# EAGLE design TaSCUD ver03 (EAGLE 8.1.1)
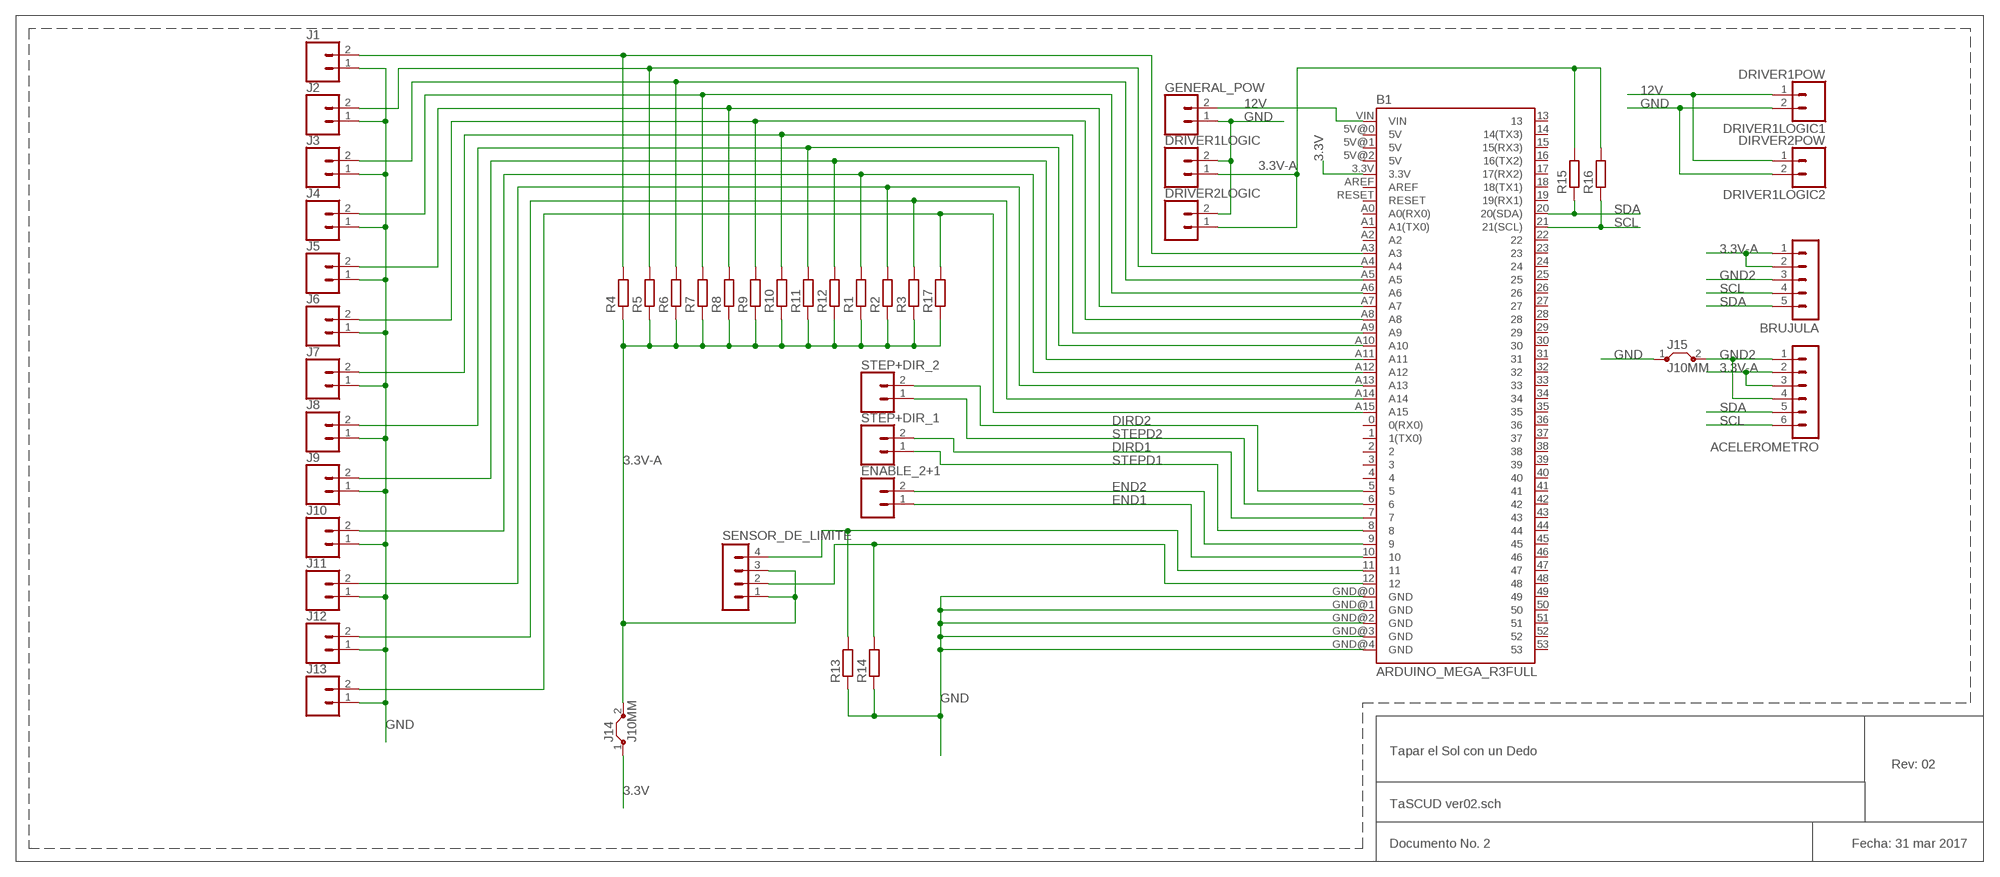
[diagram p0: schematic, sheet 1]

## Parts
ACELEROMETRO  MA06-1  [MA06-1]
B1  ARDUINO_MEGA_R3FULL  [ARDUINO_MEGA]
BRUJULA  MA05-1  [MA05-1]
DRIVER1LOGIC  CONN_023.5MM-NO_SILK  [SCREWTERMINAL-3.5MM-2-NS]
DRIVER1LOGIC1  DRIVER1POW  CONN_023.5MM-NO_SILK  [SCREWTERMINAL-3.5MM-2-NS]
DRIVER1LOGIC2  DIRVER2POW  CONN_023.5MM-NO_SILK  [SCREWTERMINAL-3.5MM-2-NS]
DRIVER2LOGIC  CONN_023.5MM-NO_SILK  [SCREWTERMINAL-3.5MM-2-NS]
ENABLE_2+1  CONN_023.5MM-NO_SILK  [SCREWTERMINAL-3.5MM-2-NS]
GENERAL_POW  CONN_023.5MM-NO_SILK  [SCREWTERMINAL-3.5MM-2-NS]
J1  CONN_023.5MM-NO_SILK  [SCREWTERMINAL-3.5MM-2-NS]
J2  CONN_023.5MM-NO_SILK  [SCREWTERMINAL-3.5MM-2-NS]
J3  CONN_023.5MM-NO_SILK  [SCREWTERMINAL-3.5MM-2-NS]
J4  CONN_023.5MM-NO_SILK  [SCREWTERMINAL-3.5MM-2-NS]
J5  CONN_023.5MM-NO_SILK  [SCREWTERMINAL-3.5MM-2-NS]
J6  CONN_023.5MM-NO_SILK  [SCREWTERMINAL-3.5MM-2-NS]
J7  CONN_023.5MM-NO_SILK  [SCREWTERMINAL-3.5MM-2-NS]
J8  CONN_023.5MM-NO_SILK  [SCREWTERMINAL-3.5MM-2-NS]
J9  CONN_023.5MM-NO_SILK  [SCREWTERMINAL-3.5MM-2-NS]
J10  CONN_023.5MM-NO_SILK  [SCREWTERMINAL-3.5MM-2-NS]
J11  CONN_023.5MM-NO_SILK  [SCREWTERMINAL-3.5MM-2-NS]
J12  CONN_023.5MM-NO_SILK  [SCREWTERMINAL-3.5MM-2-NS]
J13  CONN_023.5MM-NO_SILK  [SCREWTERMINAL-3.5MM-2-NS]
J14  J10MM  [10]
J15  J10MM  [10]
R1  R-EU_0204/7  [0204/7]
R2  R-EU_0204/7  [0204/7]
R3  R-EU_0204/7  [0204/7]
R4  R-EU_0204/7  [0204/7]
R5  R-EU_0204/7  [0204/7]
R6  R-EU_0204/7  [0204/7]
R7  R-EU_0204/7  [0204/7]
R8  R-EU_0204/7  [0204/7]
R9  R-EU_0204/7  [0204/7]
R10  R-EU_0204/7  [0204/7]
R11  R-EU_0204/7  [0204/7]
R12  R-EU_0204/7  [0204/7]
R13  R-EU_0204/7  [0204/7]
R14  R-EU_0204/7  [0204/7]
R15  R-EU_0204/7  [0204/7]
R16  R-EU_0204/7  [0204/7]
R17  R-EU_0204/7  [0204/7]
SENSOR_DE_LIMITE  MA04-1  [MA04-1]
STEP+DIR_1  CONN_023.5MM-NO_SILK  [SCREWTERMINAL-3.5MM-2-NS]
STEP+DIR_2  CONN_023.5MM-NO_SILK  [SCREWTERMINAL-3.5MM-2-NS]

## Nets
3.3V: B1.3.3V J14.1
3.3V-A: ACELEROMETRO.2 ACELEROMETRO.3 BRUJULA.1 BRUJULA.2 DRIVER1LOGIC.1 DRIVER2LOGIC.1 J14.2 R1.1 R2.1 R3.1 R4.1 R5.1 R6.1 R7.1 R8.1 R9.1 R10.1 R11.1 R12.1 R15.2 R16.2 R17.1 SENSOR_DE_LIMITE.1 SENSOR_DE_LIMITE.3
12V: B1.VIN DRIVER1LOGIC1.1 DRIVER1LOGIC2.1 GENERAL_POW.2
DIRD1: B1.7 STEP+DIR_1.2
DIRD2: B1.5 STEP+DIR_2.2
END1: B1.10 ENABLE_2+1.1
END2: B1.9 ENABLE_2+1.2
GND: B1.GND@0(GND) B1.GND@1(GND) B1.GND@2(GND) B1.GND@3(GND) B1.GND@4(GND) DRIVER1LOGIC1.2 DRIVER1LOGIC2.2 DRIVER1LOGIC.2 DRIVER2LOGIC.2 GENERAL_POW.1 J1.1 J2.1 J3.1 J4.1 J5.1 J6.1 J7.1 J8.1 J9.1 J10.1 J11.1 J12.1 J13.1 J15.1 R13.1 R14.1
GND2: ACELEROMETRO.1 ACELEROMETRO.4 BRUJULA.3 J15.2
N$1: B1.A12 J10.2 R1.2
N$2: B1.A13 J11.2 R2.2
N$3: B1.A14 J12.2 R3.2
N$4: B1.A15 J13.2 R17.2
N$9: B1.A3 J1.2 R4.2
N$10: B1.11 R13.2 SENSOR_DE_LIMITE.4
N$13: B1.A4 J2.2 R5.2
N$14: B1.A5 J3.2 R6.2
N$15: B1.A6 J4.2 R7.2
N$16: B1.A7 J5.2 R8.2
N$17: B1.A8 J6.2 R9.2
N$18: B1.A9 J7.2 R10.2
N$19: B1.A10 J8.2 R11.2
N$20: B1.A11 J9.2 R12.2
N$21: B1.12 R14.2 SENSOR_DE_LIMITE.2
SCL: ACELEROMETRO.6 B1.21(21(SCL)) BRUJULA.4 R16.1
SDA: ACELEROMETRO.5 B1.20(20(SDA)) BRUJULA.5 R15.1
STEPD1: B1.8 STEP+DIR_1.1
STEPD2: B1.6 STEP+DIR_2.1
Unconnected: B1.0(0(RX0)) B1.1(1(TX0)) B1.2 B1.3 B1.4 B1.5V@0(5V) B1.5V@1(5V) B1.5V@2(5V) B1.13 B1.14(14(TX3)) B1.15(15(RX3)) B1.16(16(TX2)) B1.17(17(RX2)) B1.18(18(TX1)) B1.19(19(RX1)) B1.22 B1.23 B1.24 B1.25 B1.26 B1.27 B1.28 B1.29 B1.30 B1.31 B1.32 B1.33 B1.34 B1.35 B1.36 B1.37 B1.38 B1.39 B1.40 B1.41 B1.42 B1.43 B1.44 B1.45 B1.46 B1.47 B1.48 B1.49 B1.50 B1.51 B1.52 B1.53 B1.A0(A0(RX0)) B1.A1(A1(TX0)) B1.A2 B1.AREF B1.RESET

## Notes on the sheet
- Tapar el Sol con un Dedo
- Rev: 02
- TaSCUD ver02.sch
- Documento No. 2 | Fecha: 31 mar 2017

## Library data of the parts
ACELEROMETRO = con-lstb:MA06-1: PIN HEADER; OC_FARNELL: unknown; OC_NEWARK: unknown
B1 = SparkFun-Boards:ARDUINO_MEGA_R3: Arduino Mega R3 ATmega2560 R3 compatible footprint. SparkFun Products: Arduino Mega 2560 R3 <https://www.sparkfun.com/products/11061>
BRUJULA = con-lstb:MA05-1: PIN HEADER; OC_FARNELL: unknown; OC_NEWARK: unknown
DRIVER1LOGIC DRIVER1LOGIC1 DRIVER1LOGIC2 DRIVER2LOGIC ENABLE_2+1 GENERAL_POW J1-J13 STEP+DIR_1 STEP+DIR_2 = SparkFun-Connectors:CONN_02: Multi connection point. Often used as Generic Header-pin footprint for 0.1 inch spaced/style header connections On any of the 0.1 inch spaced packages, you can populate with these: Break Away Headers - Straight <https://www.sparkfun.com/products/116> (PRT-00116) Break Away Male Headers - Right Angle <https://www.sparkfun.com/products/553> (PRT-00553) Female Headers <https://www.sparkfun.com/products/115> (PRT-00115) Break Away Headers - Machine Pin <https://www.sparkfun.com/products/117> (PRT-00117) Break Away Female Headers - Swiss Machine Pin <https://www.sparkfun.com/products/743> (PRT-00743) For SCREWTERMINALS and SPRING TERMINALS visit here: Screw Terimnals on SparkFun.com <https://www.sparkfun.com/search/results?term=Screw+Terminals> (5mm/3.5mm/2.54mm spacing) This device is also useful as a general connection point to wire up your design to another part of your project. Our various solder wires solder well into these plated through hole pads. Hook-Up Wire - Assortment (Stranded, 22 AWG) <https://www.sparkfun.com/products/11375> (PRT-11375) Hook-Up Wire - Assortment (Solid Core, 22 AWG) <https://www.sparkfun.com/products/11367> (PRT-11367) View the entire wire category on our website here <https://www.sparkfun.com/categories/141> Special notes: Molex polarized connector foot print use with: PRT-08233 with associated crimp pins and housings. 2.54_SCREWTERM for use with PRT-10571. 3.5mm Screw Terminal footprints for PRT-08084 5mm Screw Terminal footprints for use with PRT-08432; PROD_ID: CONN-08399
J14 J15 = jumper:J: Bridge
R1-R17 = rcl:R-EU_: RESISTOR, European symbol
SENSOR_DE_LIMITE = con-lstb:MA04-1: PIN HEADER; OC_FARNELL: unknown; OC_NEWARK: unknown

## Board
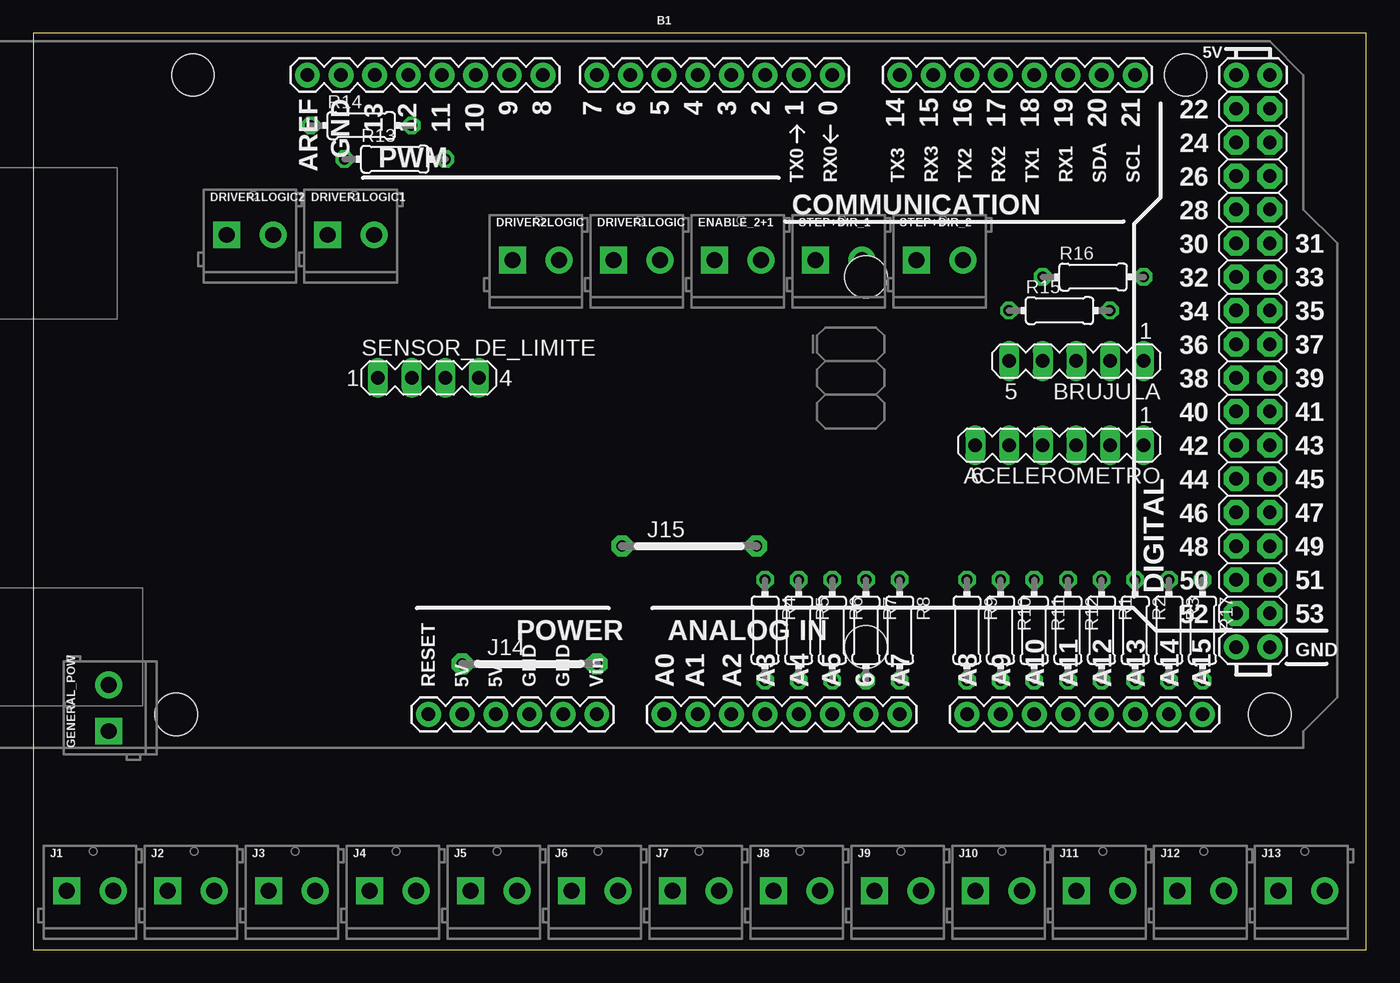
[diagram p1: board, top side]
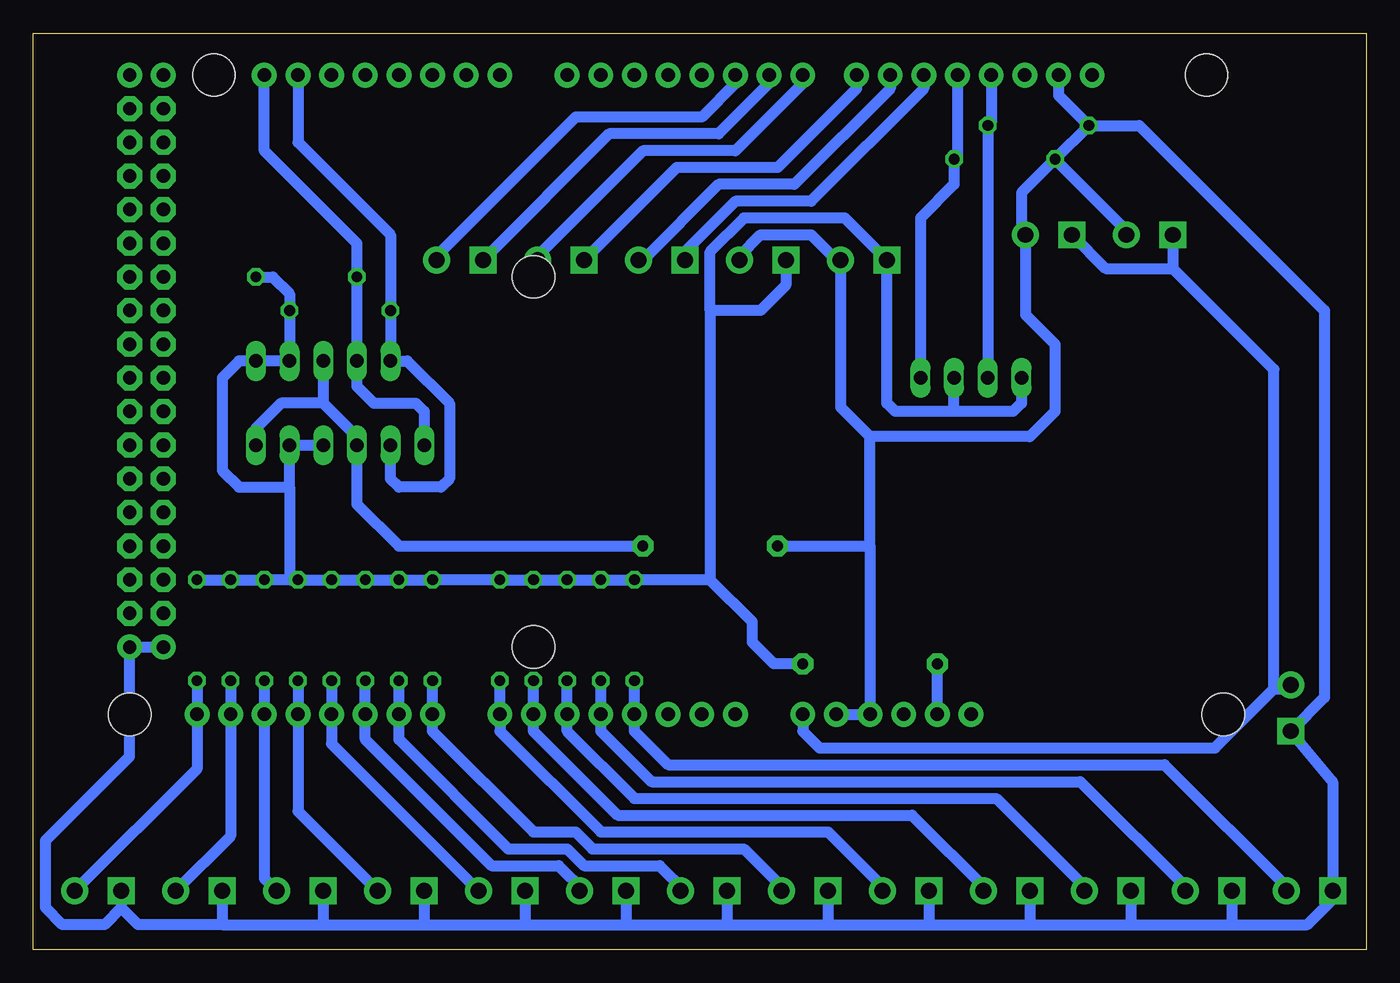
[diagram p2: board, bottom side, seen from below]

Size 100.63 x 69.2 mm. Coordinates in mm from the lower left corner, seen from the top.
Outline: 0,0 100.63,0 100.63,69.2 0,69.2 0,0
Copper layers (1*16): Top 0.035mm / dielectric 1.5mm / Bottom 0.035mm
Design rules "default": minimum track width 10mil, minimum drill 24mil, track to track 8mil, track to pad 8mil, pad to pad 8mil, via to via 8mil, smd to smd 8mil, copper to edge 40mil, drill to drill 8mil, minimum pad ring 10mil, minimum via ring 8mil, stop-mask expansion 4mil, vias tented up to drill 0mil, thermal gap 10mil

### Footprints (pad centres in the part's own frame; a part is rotated, then mirrored left to right if it is on the bottom)
MA06-1 = drill 1.016 long: 1 -6.35,0; 2 -3.81,0; 3 -1.27,0; 4 1.27,0; 5 3.81,0; 6 6.35,0
ARDUINO_MEGA = drill 1.016 pad 1.88: 0 13.97,24.13; 1 11.43,24.13; 2 8.89,24.13; 3 6.35,24.13; 3.3V -13.97,-24.13; 4 3.81,24.13; 5 1.27,24.13; 5V@0 -11.43,-24.13; 5V@1 44.45,24.13; 5V@2 46.99,24.13; 6 -1.27,24.13; 7 -3.81,24.13; 8 -7.874,24.13; 9 -10.414,24.13; 10 -12.954,24.13; 11 -15.494,24.13; 12 -18.034,24.13; 13 -20.574,24.13; 14 19.05,24.13; 15 21.59,24.13; 16 24.13,24.13; 17 26.67,24.13; 18 29.21,24.13; 19 31.75,24.13; 20 34.29,24.13; 21 36.83,24.13; A0 1.27,-24.13; A1 3.81,-24.13; A2 6.35,-24.13; A3 8.89,-24.13; A4 11.43,-24.13; A5 13.97,-24.13; A6 16.51,-24.13; A7 19.05,-24.13; A8 24.13,-24.13; A9 26.67,-24.13; A10 29.21,-24.13; A11 31.75,-24.13; A12 34.29,-24.13; A13 36.83,-24.13; A14 39.37,-24.13; A15 41.91,-24.13; AREF -25.654,24.13; GND@0 -8.89,-24.13; GND@1 -6.35,-24.13; GND@2 44.45,-19.05; GND@3 46.99,-19.05; GND@4 -23.114,24.13; RESET -16.51,-24.13; VIN -3.81,-24.13 | drill 1.016 pad 1.88 octagon: 22 44.45,21.59; 23 46.99,21.59; 24 44.45,19.05; 25 46.99,19.05; 26 44.45,16.51; 27 46.99,16.51; 28 44.45,13.97; 29 46.99,13.97; 30 44.45,11.43; 31 46.99,11.43; 32 44.45,8.89; 33 46.99,8.89; 34 44.45,6.35; 35 46.99,6.35; 36 44.45,3.81; 37 46.99,3.81; 38 44.45,1.27; 39 46.99,1.27; 40 44.45,-1.27; 41 46.99,-1.27; 42 44.45,-3.81; 43 46.99,-3.81; 44 44.45,-6.35; 45 46.99,-6.35; 46 44.45,-8.89; 47 46.99,-8.89; 48 44.45,-11.43; 49 46.99,-11.43; 50 44.45,-13.97; 51 46.99,-13.97; 52 44.45,-16.51; 53 46.99,-16.51 | hole 3.2: -34.29,24.13; -35.56,-24.13; 16.51,8.89; 16.51,-19.05; 40.64,24.13; 46.99,-24.13
MA05-1 = drill 1.016 long: 1 -5.08,0; 2 -2.54,0; 3 0,0; 4 2.54,0; 5 5.08,0
SCREWTERMINAL-3.5MM-2-NS = drill 1.2 pad 2.032 square: 1 0,0 | drill 1.2 pad 2.032: 2 3.5,0
10 = drill 0.813 pad 1.6 octagon: 1 -5.08,0; 2 5.08,0
0204/7 = drill 0.813 octagon: 1 -3.81,0; 2 3.81,0
MA04-1 = drill 1.016 long: 1 -3.81,0; 2 -1.27,0; 3 1.27,0; 4 3.81,0

### Placement (x,y rotation side)
ACELEROMETRO  77.47,38.1 180 top
B1  46.36,41.91 0 top
BRUJULA  78.74,44.45 180 top
DRIVER1LOGIC  43.82,52.07 0 top
DRIVER1LOGIC1  22.22,53.97 0 top
DRIVER1LOGIC2  14.61,53.97 0 top
DRIVER2LOGIC  36.2,52.07 0 top
ENABLE_2+1  51.44,52.07 0 top
GENERAL_POW  5.71,16.51 90 top
J1  2.54,4.45 0 top
J2  10.16,4.45 0 top
J3  17.78,4.45 0 top
J4  25.4,4.45 0 top
J5  33.02,4.45 0 top
J6  40.64,4.45 0 top
J7  48.26,4.45 0 top
J8  55.88,4.45 0 top
J9  63.5,4.45 0 top
J10  71.12,4.45 0 top
J11  78.74,4.45 0 top
J12  86.36,4.45 0 top
J13  93.98,4.45 0 top
J14  37.47,21.59 0 top
J15  49.53,30.48 0 top
R1  80.64,24.13 270 top
R2  83.18,24.13 270 top
R3  85.72,24.13 270 top
R4  55.25,24.13 270 top
R5  57.79,24.13 270 top
R6  60.33,24.13 270 top
R7  62.87,24.13 270 top
R8  65.41,24.13 270 top
R9  70.48,24.13 270 top
R10  73.02,24.13 270 top
R11  75.56,24.13 270 top
R12  78.1,24.13 270 top
R13  27.3,59.69 0 top
R14  24.76,62.23 0 top
R15  77.47,48.26 0 top
R16  80.01,50.8 0 top
R17  88.27,24.13 270 top
SENSOR_DE_LIMITE  29.84,43.18 0 top
STEP+DIR_1  59.05,52.07 0 top
STEP+DIR_2  66.67,52.07 0 top

### Tracks (layer width: path | path; a pad name or v marks a point on that pad's centre or on a via)
3.3V
  Bottom 0.813: B1.3.3V J14.1
3.3V-A
  Bottom 0.813: R17.1 R3.1 R2.1 81.28,27.94 | 49.53,27.94 R4.1 R5.1 R6.1 R7.1 R8.1 R9.1 R10.1 R11.1 R12.1 R1.1 81.28,27.94 | 49.53,27.94 46.36,24.77 46.36,23.23 44.72,21.59 J14.2 | SENSOR_DE_LIMITE.1 26.04,41.27 26.67,40.64 31.11,40.64 | 31.11,40.64 SENSOR_DE_LIMITE.3 | 31.11,40.64 35.56,40.64 36.2,41.27 DRIVER2LOGIC.1 39.37,55.24 46.99,55.24 49.53,52.7 49.53,48.26 | 49.53,48.26 49.53,27.94 | DRIVER1LOGIC.1 43.82,50.16 45.72,48.26 49.53,48.26 | ACELEROMETRO.3 ACELEROMETRO.2 81.28,34.92 | R16.2 82.55,50.8 81.28,49.53 R15.2 BRUJULA.2 BRUJULA.1 85.09,44.45 86.36,43.18 86.36,36.2 85.09,34.92 81.28,34.92 | 81.28,34.92 81.28,27.94
12V
  Bottom 0.813: B1.VIN 42.55,16.51 41.27,15.24 11.43,15.24 6.99,19.69 | 6.99,19.69 6.04,19.69 GENERAL_POW.2 | DRIVER1LOGIC1.1 19.68,51.43 14.61,51.43 | DRIVER1LOGIC2.1 14.61,51.43 | 6.99,19.69 6.99,43.81 14.61,51.43
DIRD1
  Bottom 0.813: B1.7 42.55,65.41 47.62,60.33 54.61,60.33 62.87,52.07 62.87,52.38 STEP+DIR_1.2
DIRD2
  Bottom 0.813: B1.5 47.62,65.41 50.16,62.86 59.69,62.86 70.48,52.07 70.48,51.74 STEP+DIR_2.2
END1
  Bottom 0.813: B1.10 33.4,65.02 41.91,56.52 47.62,56.52 51.44,52.7 ENABLE_2+1.1
END2
  Bottom 0.813: B1.9 35.94,65.02 43.18,57.78 48.9,57.78 54.61,52.07 55.25,52.38 ENABLE_2+1.2
GND
  Bottom 0.813: J13.1 93.98,3.18 | 93.98,3.18 92.71,1.9 86.36,1.9 | 17.78,1.9 10.16,1.9 | 25.4,1.9 17.78,1.9 | 33.02,1.9 25.4,1.9 | 40.64,1.9 33.02,1.9 | 48.26,1.9 40.64,1.9 | 55.88,1.9 48.26,1.9 | 63.5,1.9 55.88,1.9 | 71.12,1.9 63.5,1.9 | 78.74,1.9 71.12,1.9 | 86.36,1.9 78.74,1.9 | 10.16,1.9 4.45,1.9 2.54,3.81 J1.1 2.54,12.7 GENERAL_POW.1 3.17,19.05 3.17,48.26 17.14,62.23 R14.1 | J2.1 10.16,1.9 | J3.1 17.78,1.9 | J4.1 25.4,1.9 | J5.1 33.02,1.9 | J6.1 40.64,1.9 | J7.1 48.26,1.9 | J8.1 55.88,1.9 | J9.1 63.5,1.9 | J10.1 71.12,1.9 | J11.1 78.74,1.9 | J12.1 86.36,1.9 | B1.GND@2 B1.GND@3 93.34,14.6 99.69,8.25 99.69,3.18 98.42,1.9 95.25,1.9 93.98,3.18 | B1.GND@1 B1.GND@0 37.47,30.48 | B1.GND@4 23.24,64.52 R14.1 | R14.1 R13.1 | R13.1 26.04,57.15 26.04,54.28 DRIVER1LOGIC1.2 25.72,47.95 23.49,45.72 23.49,40.64 25.4,38.73 37.47,38.73 | R13.1 18.41,54.61 18.41,54.28 DRIVER1LOGIC2.2 | 37.47,38.73 39.7,40.96 DRIVER2LOGIC.2 40.01,51.74 40.01,52.07 41.91,53.97 45.72,53.97 47.32,52.38 DRIVER1LOGIC.2 | 37.47,30.48 37.47,38.73 | J15.1 37.47,30.48
GND2
  Bottom 0.813: 78.74,41.27 76.2,38.73 ACELEROMETRO.4 76.2,33.66 73.02,30.48 J15.2 | 78.74,41.27 81.91,41.27 83.82,39.37 ACELEROMETRO.1 | BRUJULA.3 78.74,41.27
N$1
  Bottom 0.813: R1.2 B1.A12 80.64,10.47 J10.2
N$2
  Bottom 0.813: R2.2 B1.A13 83.18,5.39 J11.2
N$3
  Bottom 0.813: R3.2 B1.A14 85.72,8.58 J12.2
N$4
  Bottom 0.813: R17.2 B1.A15 88.27,13.66 J13.2
N$9
  Bottom 0.813: J1.2 5.71,4.75 5.71,4.45 15.24,13.97 52.71,13.97 55.25,16.51 B1.A3 R4.2
N$10
  Bottom 0.813: B1.11 30.86,59.94 R13.2 31.11,57.78 33.66,55.24 SENSOR_DE_LIMITE.4
N$13
  Bottom 0.813: J2.2 13.34,4.75 13.34,4.45 21.59,12.7 53.98,12.7 57.79,16.51 B1.A4 R5.2
N$14
  Bottom 0.813: J3.2 20.95,4.75 20.95,4.45 27.94,11.43 55.25,11.43 60.33,16.51 B1.A5 R6.2
N$15
  Bottom 0.813: J4.2 28.57,4.75 28.57,4.45 34.29,10.16 56.52,10.16 62.87,16.51 B1.A6 R7.2
N$16
  Bottom 0.813: J5.2 36.2,4.75 36.2,4.45 40.64,8.89 57.79,8.89 65.41,16.51 B1.A7 R8.2
N$17
  Bottom 0.813: J6.2 43.82,4.75 43.82,4.45 46.99,7.62 58.42,7.62 59.69,8.89 62.87,8.89 70.48,16.51 B1.A8 R9.2
N$18
  Bottom 0.813: J7.2 51.44,4.75 51.44,4.45 53.34,6.35 59.05,6.35 60.33,7.62 64.77,7.62 73.02,15.87 B1.A9 R10.2
N$19
  Bottom 0.813: J8.2 59.05,4.75 59.05,4.45 60.96,6.35 66.04,6.35 75.56,15.87 B1.A10 R11.2
N$20
  Bottom 0.813: R12.2 B1.A11 78.1,15.55 J9.2
N$21
  Bottom 0.813: B1.12 28.32,62.48 R14.2 SENSOR_DE_LIMITE.2
SCL
  Bottom 0.813: B1.21 83.18,60.33 76.2,53.34 R16.1 BRUJULA.4 76.2,42.54 74.93,41.27 71.75,41.27 71.12,40.64 ACELEROMETRO.6
SDA
  Bottom 0.813: B1.20 80.64,60.96 73.66,53.97 R15.1 BRUJULA.5 72.39,44.45 69.21,41.27 69.21,35.56 69.85,34.92 73.02,34.92 73.66,35.56 ACELEROMETRO.5
STEPD1
  Bottom 0.813: B1.8 38.48,65.02 44.45,59.05 52.07,59.05 STEP+DIR_1.1
STEPD2
  Bottom 0.813: B1.6 45.09,65.41 48.9,61.59 57.15,61.59 STEP+DIR_2.1